# Altium schematic sheet Power_5V.SchDoc
size A; SheetNumber: 3; SheetTotal: 9
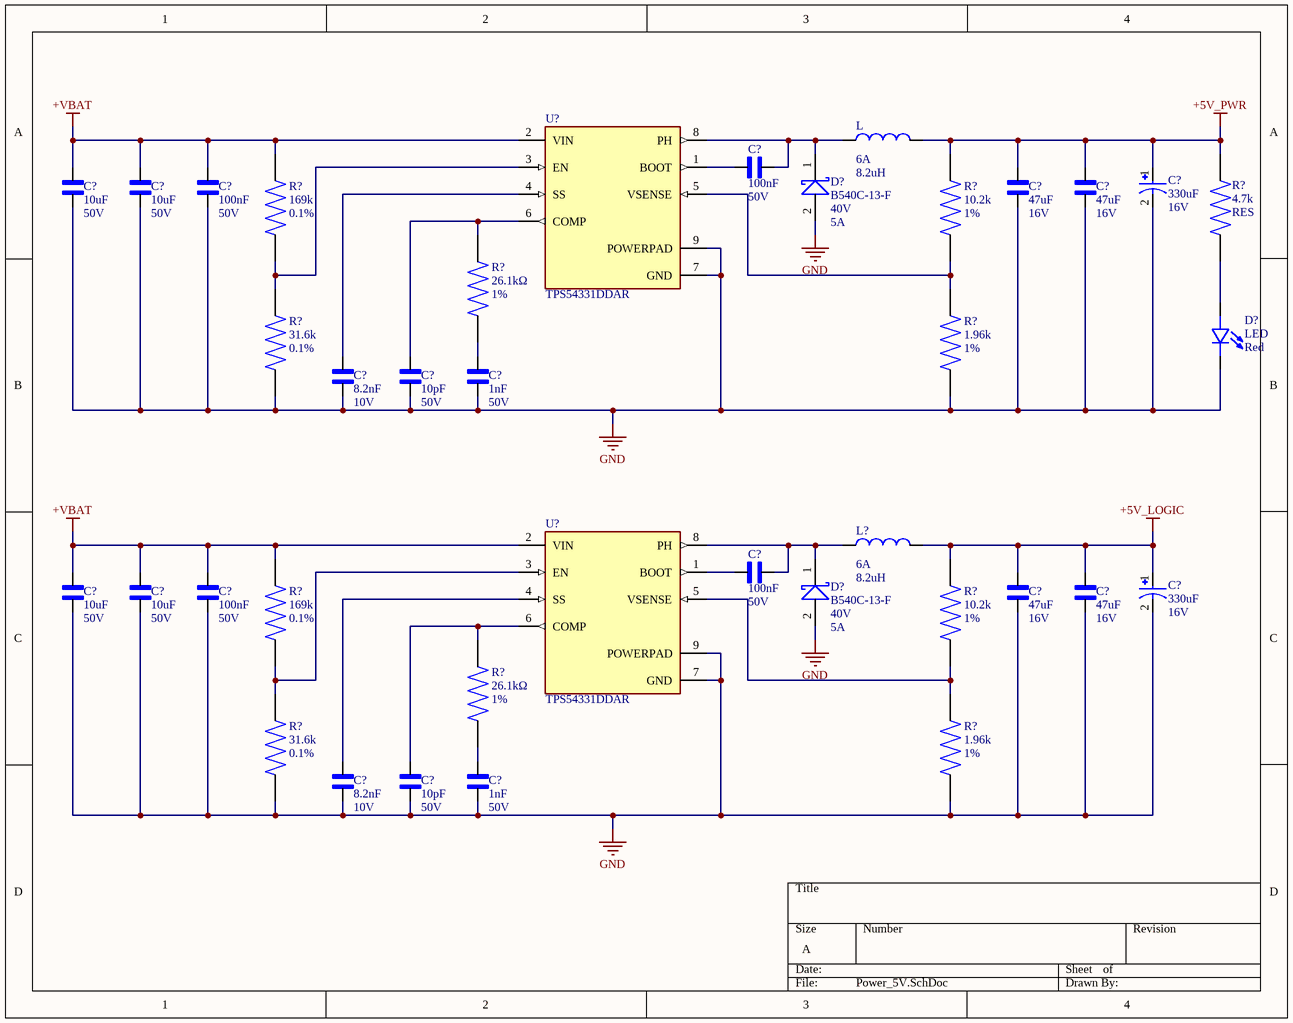
[diagram p0: Power_5V.SchDoc]

## Parts
(Parts that share a designator on the sheet are numbered #1, #2 ... from top to bottom, then left to right.)
C?#1  value 100nF  Voltage Rating: 50V  [N_P_CAP_0402]  (hidden comment: N_P_CAP)
C?#2  value 330uF  Voltage Rating: 16V  [P_CAP_6.3X7.7]  (hidden comment: P_CAP)
C?#3  value 10uF  Voltage Rating: 50V  [N_P_CAP_1206]  (hidden comment: N_P_CAP)
C?#4  value 10uF  Voltage Rating: 50V  [N_P_CAP_1206]  (hidden comment: N_P_CAP)
C?#5  value 100nF  Voltage Rating: 50V  [N_P_CAP_0402]  (hidden comment: N_P_CAP)
C?#6  value 47uF  Voltage Rating: 16V  [N_P_CAP_1210]  (hidden comment: N_P_CAP)
C?#7  value 47uF  Voltage Rating: 16V  [N_P_CAP_1210]  (hidden comment: N_P_CAP)
C?#8  value 8.2nF  Voltage Rating: 10V  [N_P_CAP_0201]  (hidden comment: N_P_CAP)
C?#9  value 10pF  Voltage Rating: 50V  [N_P_CAP_0805]  (hidden comment: N_P_CAP)
C?#10  value 1nF  Voltage Rating: 50V  [N_P_CAP_0402]  (hidden comment: N_P_CAP)
C?#11  value 100nF  Voltage Rating: 50V  [N_P_CAP_0402]  (hidden comment: N_P_CAP)
C?#12  value 330uF  Voltage Rating: 16V  [P_CAP_6.3X7.7]  (hidden comment: P_CAP)
C?#13  value 10uF  Voltage Rating: 50V  [N_P_CAP_1206]  (hidden comment: N_P_CAP)
C?#14  value 10uF  Voltage Rating: 50V  [N_P_CAP_1206]  (hidden comment: N_P_CAP)
C?#15  value 100nF  Voltage Rating: 50V  [N_P_CAP_0402]  (hidden comment: N_P_CAP)
C?#16  value 47uF  Voltage Rating: 16V  [N_P_CAP_1210]  (hidden comment: N_P_CAP)
C?#17  value 47uF  Voltage Rating: 16V  [N_P_CAP_1210]  (hidden comment: N_P_CAP)
C?#18  value 8.2nF  Voltage Rating: 10V  [N_P_CAP_0201]  (hidden comment: N_P_CAP)
C?#19  value 10pF  Voltage Rating: 50V  [N_P_CAP_0805]  (hidden comment: N_P_CAP)
C?#20  value 1nF  Voltage Rating: 50V  [N_P_CAP_0402]  (hidden comment: N_P_CAP)
D?#1  B540C-13-F  Voltage - DC Reverse: 40V  Current - Rectified: 5A  [DO-214AB]
D?#2  LED  Color: Red  [LED_0603]
D?#3  B540C-13-F  Voltage - DC Reverse: 40V  Current - Rectified: 5A  [DO-214AB]
L  value 8.2uH  Current - Saturation: 6A  [INDUCTOR_7X6.6]  (hidden comment: FXL0630-8R2-M)
L?  value 8.2uH  Current - Saturation: 6A  [INDUCTOR_7X6.6]  (hidden comment: FXL0630-8R2-M)
R?#1  value 169k  Tolerance: 0.1%  [RES_0402]  (hidden comment: RES)
R?#2  value 10.2k  Tolerance: 1%  [RES_0402]  (hidden comment: RES)
R?#3  RES  value 4.7k  [RES_0603]
R?#4  value 26.1kΩ  Tolerance: 1%  [RES_0402]  (hidden comment: RES)
R?#5  value 31.6k  Tolerance: 0.1%  [RES_0402]  (hidden comment: RES)
R?#6  value 1.96k  Tolerance: 1%  [RES_0402]  (hidden comment: RES)
R?#7  value 169k  Tolerance: 0.1%  [RES_0402]  (hidden comment: RES)
R?#8  value 10.2k  Tolerance: 1%  [RES_0402]  (hidden comment: RES)
R?#9  value 26.1kΩ  Tolerance: 1%  [RES_0402]  (hidden comment: RES)
R?#10  value 31.6k  Tolerance: 0.1%  [RES_0402]  (hidden comment: RES)
R?#11  value 1.96k  Tolerance: 1%  [RES_0402]  (hidden comment: RES)
U?#1  TPS54331DDAR  [CONV_TPS54331DDAR]
U?#2  TPS54331DDAR  [CONV_TPS54331DDAR]

## Nets
+5V_LOGIC: C?#12.1 C?#16.2 C?#17.2 L?.2 R?#8.2
+5V_PWR: C?#2.1 C?#6.2 C?#7.2 L.2 R?#2.2 R?#3.2
+VBAT: C?#3.2 C?#4.2 C?#5.2 C?#13.2 C?#14.2 C?#15.2 R?#1.2 R?#7.2 U?#1.2(VIN) U?#2.2(VIN)
GND: C?#2.2 C?#3.1 C?#4.1 C?#5.1 C?#6.1 C?#7.1 C?#8.1 C?#9.1 C?#10.1 C?#12.2 C?#13.1 C?#14.1 C?#15.1 C?#16.1 C?#17.1 C?#18.1 C?#19.1 C?#20.1 D?#1.2(A) D?#2.1(C) D?#3.2(A) R?#5.1 R?#6.1 R?#10.1 R?#11.1 U?#1.7(GND) U?#1.9(POWERPAD) U?#2.7(GND) U?#2.9(POWERPAD)
NetC?#1_1: C?#1.1 D?#1.1(C) L.1 U?#1.8(PH)
NetC?#1_2: C?#1.2 U?#1.1(BOOT)
NetC?#8_2: C?#8.2 U?#1.4(SS)
NetC?#9_2: C?#9.2 R?#4.2 U?#1.6(COMP)
NetC?#10_2: C?#10.2 R?#4.1
NetC?#11_1: C?#11.1 D?#3.1(C) L?.1 U?#2.8(PH)
NetC?#11_2: C?#11.2 U?#2.1(BOOT)
NetC?#18_2: C?#18.2 U?#2.4(SS)
NetC?#19_2: C?#19.2 R?#9.2 U?#2.6(COMP)
NetC?#20_2: C?#20.2 R?#9.1
NetD?#2_2: D?#2.2(A) R?#3.1
NetR?#1_1: R?#1.1 R?#5.2 U?#1.3(EN)
NetR?#2_1: R?#2.1 R?#6.2 U?#1.5(VSENSE)
NetR?#7_1: R?#7.1 R?#10.2 U?#2.3(EN)
NetR?#8_1: R?#8.1 R?#11.2 U?#2.5(VSENSE)

## Library data of the parts
C?#1 C?#5 C?#11 C?#15 = N_P_CAP: GENERIC NON-POLARIZED CAP; MPN: CC0402KRX7R9BB104; MF: YAGEO; Package: 0402; LCSC Part Number: C131394; Tolerance: *; ESR: *
C?#2 C?#12 = P_CAP: GENERIC POLARIZED CAP; MPN: EEEFTC331XAP; MF: *; LCSC Part Number: C413522; Tolerance: *; Package: *; ESR: *
C?#3 C?#4 C?#13 C?#14 = N_P_CAP: GENERIC NON-POLARIZED CAP; MPN: CC1206KKX5R9BB106; MF: YAGEO; Package: 1206; LCSC Part Number: C100122; Tolerance: *; ESR: *
C?#6 C?#7 C?#16 C?#17 = N_P_CAP: GENERIC NON-POLARIZED CAP; MPN: GRM32ER61C476KE15L; Tolerance: 10%; MF: muRata; Package: 1210; LCSC Part Number: C77101; ESR: *
C?#8 C?#18 = N_P_CAP: GENERIC NON-POLARIZED CAP; MPN: GRM033R71A822KA01D; Tolerance: 10%; MF: muRata; Package: 0201; LCSC Part Number: C2168104; ESR: *
C?#9 C?#19 = N_P_CAP: GENERIC NON-POLARIZED CAP; MPN: CC0805JRNPO9BN100; Tolerance: 5%; MF: YAGEO; Package: 0805; LCSC Part Number: C107107; ESR: *
C?#10 C?#20 = N_P_CAP: GENERIC NON-POLARIZED CAP; MPN: GRM1555C1H102JA01J; Tolerance: 5%; MF: muRata; Package: 0402; LCSC Part Number: C2176577; ESR: *
D?#1 D?#3 = SCHOTTKY_DIODE: GENERIC SCHOTTKY DIODE; Voltage - Forward: 550mV@5A; Power Dissipation: *; LCSC Part Number: C72264
D?#2 = LED: GENERIC LED; MPN: *; Forward Voltage: *; Package: *; LCSC Part Number: C965799; Forward Current: *
L L? = INDUCTOR: GENERIC INDUCTOR; MF: cjiang; MPN: FXL0630-8R2-M; Package: SMD,7x6.6mm; LCSC Part Number: C167222; Current Rating: *; DC Resistance: *
R?#1 R?#7 = RES: GENERIC RES; MPN: RT0402BRD07169KL; Power Rating: 62.5mW; Voltage Rating: 50V; Temperature Coefficient: *; Package: 0402; LCSC Part Number: C852555
R?#2 R?#8 = RES: GENERIC RES; MPN: CRCW040210K2FKED; Power Rating: 62.5mW; Voltage Rating: 50V; Temperature Coefficient: 100ppm/*C; Package: 0402; LCSC Part Number: C481923
R?#3 = RES: GENERIC RES; MPN: RC0603FR-074K7L; Power Rating: 100mW; Voltage Rating: 75V; Tolerance: *; Temperature Coefficient: *; Package: 0603; LCSC Part Number: C99782
R?#4 R?#9 = RES: GENERIC RES; MPN: CRCW040226K1FKED; Power Rating: 62.5mW; Temperature Coefficient: 100ppm/*C; Voltage Rating: *; Package: 0402; LCSC Part Number: C3008932
R?#5 R?#10 = RES: GENERIC RES; MPN: RT0402BRD0731K6L; Power Rating: 62.5mW; Voltage Rating: 50V; Temperature Coefficient: 25ppm/*C; Package: 0402; LCSC Part Number: C852720
R?#6 R?#11 = RES: GENERIC RES; MPN: CRCW04021K96FKED; Power Rating: 62.5mW; Voltage Rating: 50V; Temperature Coefficient: 100ppm/*C; Package: 0402; LCSC Part Number: C2092068
U?#1 U?#2 = TPS54331DDAR: 3.5V to 28V Input, 3A, 570kHz Step-Down Converter with Eco-mode; MF: Texas Instruments; SnapEDA_Link: https://www.snapeda.com/parts/TPS54331DDAR/Texas+Instruments/view-part/?ref=snap; Purchase-URL: https://pricing.snapeda.com/search/part/TPS54331DDAR/?ref=eda; Package: HSOIC-8 Texas Instruments; MP: TPS54331DDAR; Price: None; Availability: In Stock; Check_prices: https://www.snapeda.com/parts/TPS54331DDAR/Texas+Instruments/view-part/?ref=eda; Value: *